# Altium schematic sheet LINK_PAGE.SchDoc
size A; SheetNumber: 1; SheetTotal: 10
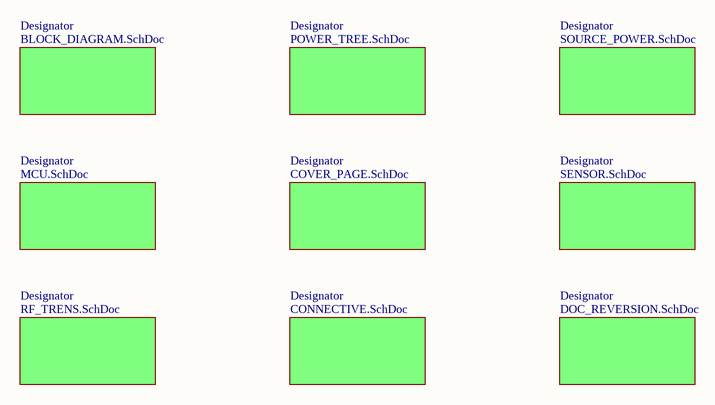
[diagram p0: LINK_PAGE.SchDoc]

## Sub-sheets
Designator = BLOCK_DIAGRAM.SchDoc: no entries
Designator = POWER_TREE.SchDoc: no entries
Designator = SOURCE_POWER.SchDoc: no entries
Designator = MCU.SchDoc: no entries
Designator = COVER_PAGE.SchDoc: no entries
Designator = SENSOR.SchDoc: no entries
Designator = RF_TRENS.SchDoc: no entries
Designator = CONNECTIVE.SchDoc: no entries
Designator = DOC_REVERSION.SchDoc: no entries